# EAGLE design chgr (EAGLE 4.13)
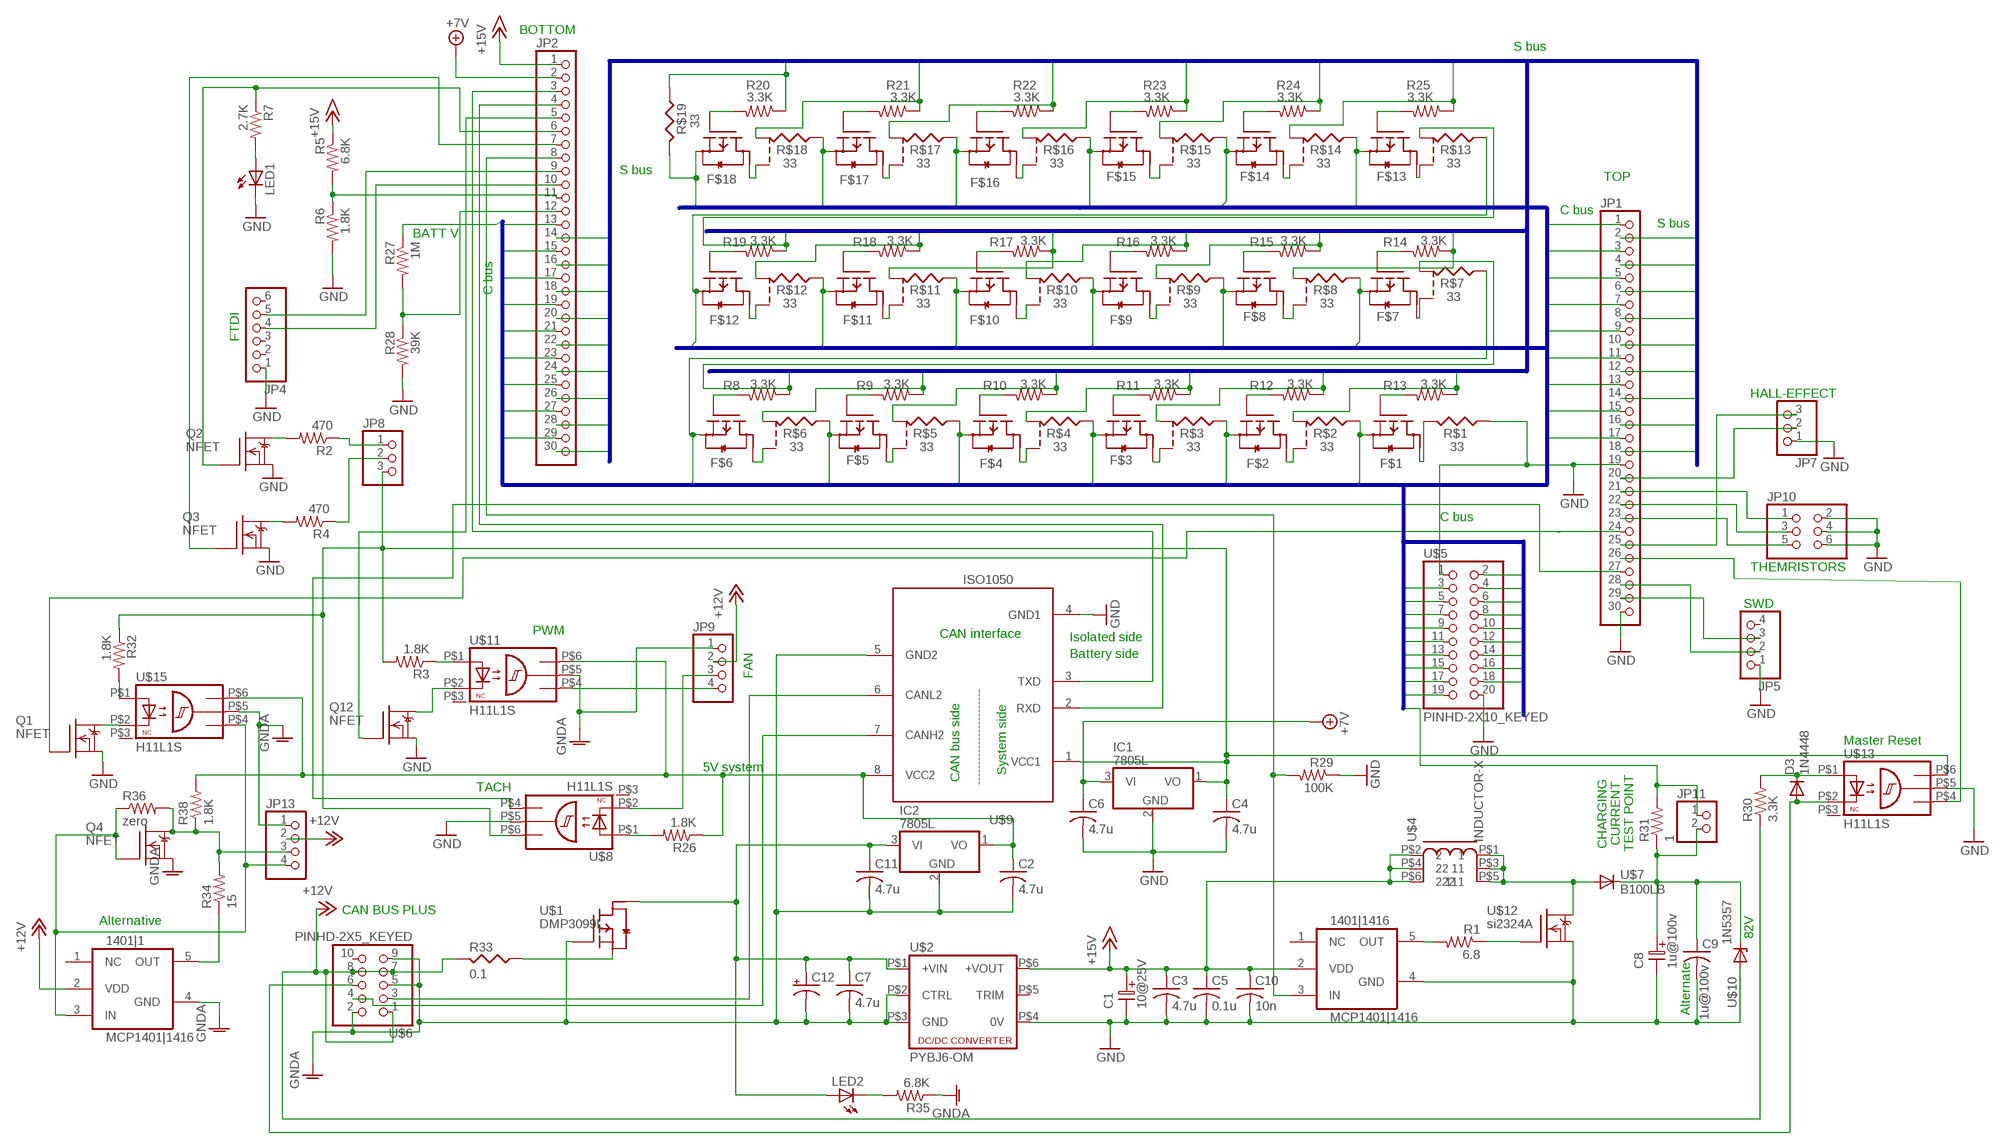
[diagram p0: schematic, sheet 1]

## Parts
1401|1  MCP1401|1416  MCP1416  [SOT23-5]
1401|1416  MCP1401|1416  MCP1416  [SOT23-5]
C1  10@25V  ELC-2,5L  [ES-2,5L]
C2  4.7u  C-USC0603  [C0603]
C3  4.7u  C-USC0805  [C0805]
C4  4.7u  C-USC0603  [C0603]
C5  0.1u  C-USC0603  [C0603]
C6  4.7u  C-USC0603  [C0603]
C7  4.7u  C-USC0603  [C0603]
C8  1u@100v  ELC-2,5L  [ES-2,5L]
C9  1u@100v  C-USC1206  [C1206]
C10  10n  C-USC0603  [C0603]
C11  4.7u  C-USC0805  [C0805]
C12  CPOL-USE5-8.5  [E5-8,5]
D3  1N4448  DIODE-SOD123  [SOD123]
F$1  FET-P-SOT23  [SOT-23]
F$2  FET-P-SOT23  [SOT-23]
F$3  FET-P-SOT23  [SOT-23]
F$4  FET-P-SOT23  [SOT-23]
F$5  FET-P-SOT23  [SOT-23]
F$6  FET-P-SOT23  [SOT-23]
F$7  FET-P-SOT23  [SOT-23]
F$8  FET-P-SOT23  [SOT-23]
F$9  FET-P-SOT23  [SOT-23]
F$10  FET-P-SOT23  [SOT-23]
F$11  FET-P-SOT23  [SOT-23]
F$12  FET-P-SOT23  [SOT-23]
F$13  FET-P-SOT23  [SOT-23]
F$14  FET-P-SOT23  [SOT-23]
F$15  FET-P-SOT23  [SOT-23]
F$16  FET-P-SOT23  [SOT-23]
F$17  FET-P-SOT23  [SOT-23]
F$18  FET-P-SOT23  [SOT-23]
IC1  7805L  [TO92]
IC2  7805L  [TO92]
JP1  PINHD-1X30  [1X30]
JP2  PINHD-1X30  [1X30]
JP4  PINHD-1X6  [1X06]
JP5  PINHD-1X4  [1X04]
JP7  PINHD-1X3  [1X03]
JP8  PINHD-1X3  [1X03]
JP9  PINHD-1X4  [1X04]
JP10  PINHD-2X3  [2X03]
JP11  PINHD-1X2  [1X02]
JP13  PINHD-1X4  [1X04]
LED1  LEDCHIP-LED0603  [CHIP-LED0603]
LED2  LEDCHIP-LED0603  [CHIP-LED0603]
Q1  NFET  DMN3404L  [SOT-23]
Q2  NFET  DMN3404L  [SOT-23]
Q3  NFET  DMN3404L  [SOT-23]
Q4  NFET  DMN3404L  [SOT-23]
Q12  NFET  DMN3404L  [SOT-23]
R1  6.8  R-US_R0603  [R0603]
R2  470  R-US_R0603  [R0603]
R3  1.8K  R-US_R0603  [R0603]
R4  470  R-US_R0603  [R0603]
R5  6.8K  R-US_R0603  [R0603]
R6  1.8K  R-US_R0603  [R0603]
R7  2.7K  R-US_R0603  [R0603]
R8  3.3K  R-US_R0603  [R0603]
R9  3.3K  R-US_R0603  [R0603]
R10  3.3K  R-US_R0603  [R0603]
R11  3.3K  R-US_R0603  [R0603]
R12  3.3K  R-US_R0603  [R0603]
R13  3.3K  R-US_R0603  [R0603]
R14  3.3K  R-US_R0603  [R0603]
R15  3.3K  R-US_R0603  [R0603]
R16  3.3K  R-US_R0603  [R0603]
R17  3.3K  R-US_R0603  [R0603]
R18  3.3K  R-US_R0603  [R0603]
R19  3.3K  R-US_R0603  [R0603]
R20  3.3K  R-US_R0603  [R0603]
R21  3.3K  R-US_R0603  [R0603]
R22  3.3K  R-US_R0603  [R0603]
R23  3.3K  R-US_R0603  [R0603]
R24  3.3K  R-US_R0603  [R0603]
R25  3.3K  R-US_R0603  [R0603]
R26  1.8K  R-US_R0603  [R0603]
R27  1M  R-US_R0603  [R0603]
R28  39K  R-US_R0603  [R0603]
R29  100K  R-US_R0603  [R0603]
R30  3.3K  R-US_R0603  [R0603]
R31  1  R-US_R0603  [R0603]
R32  1.8K  R-US_R0603  [R0603]
R33  0.1  RESUS-S2,5  [RS-2,5]
R34  15  R-US_R0603  [R0603]
R35  6.8K  R-US_R0603  [R0603]
R36  zero  R-US_R0603  [R0603]
R38  1.8K  R-US_R0603  [R0603]
R$1  33  RESUS-S2,5  [RS-2,5]
R$2  33  RESUS-S2,5-2  [RS-2,5-2]
R$3  33  RESUS-S2,5-2  [RS-2,5-2]
R$4  33  RESUS-S2,5-2  [RS-2,5-2]
R$5  33  RESUS-S2,5-2  [RS-2,5-2]
R$6  33  RESUS-S2,5-2  [RS-2,5-2]
R$7  33  RESUS-S2,5-2  [RS-2,5-2]
R$8  33  RESUS-S2,5-2  [RS-2,5-2]
R$9  33  RESUS-S2,5-2  [RS-2,5-2]
R$10  33  RESUS-S2,5-2  [RS-2,5-2]
R$11  33  RESUS-S2,5-2  [RS-2,5-2]
R$12  33  RESUS-S2,5-2  [RS-2,5-2]
R$13  33  RESUS-S2,5-2  [RS-2,5-2]
R$14  33  RESUS-S2,5-2  [RS-2,5-2]
R$15  33  RESUS-S2,5-2  [RS-2,5-2]
R$16  33  RESUS-S2,5-2  [RS-2,5-2]
R$17  33  RESUS-S2,5-2  [RS-2,5-2]
R$18  33  RESUS-S2,5-2  [RS-2,5-2]
R$19  33  RESUS-S2,5  [RS-2,5]
U$1  DMP3099L  FET-P-SOT23  [SOT-23]
U$2  PYBJ6-OM  [PYBJ6-OM]
U$4  INDUCTOR-X  [INDUCTOR]
U$5  PINHD-2X10_KEYED  [2X10_KEYED]
U$6  PINHD-2X5_KEYED  [2X05_KEYED]
U$7  B100LB  [SMB_1]
U$8  H11L1S  H!!LX  [SMD-6]
U$9  ISO1050  [PDSO-G8]
U$10  1N5357  ZENER-5W-VERT  [ZENER-VERT]
U$11  H11L1S  H!!LX  [SMD-6]
U$12  si2324A  DMN3404L  [SOT-23]
U$13  H11L1S  H!!LX  [SMD-6]
U$15  H11L1S  H!!LX  [SMD-6]

## Nets
15VDIVIDED: JP2.11 R5.2 R6.1
+5VA: C2.1 IC2.1(VO) R26.1 R38.2 U$9.8(VCC2) U$11.P$6(VCC) U$15.P$6(VCC)
+5VB: C4.1 IC1.1(VO) JP8.3 R3.2 R32.1 U$8.P$6(VCC) U$9.1(VCC1) U$13.P$6(VCC)
+7V: C6.1 IC1.3(VI) JP2.2
+12V: 1401|1.2(VDD) JP9.2 JP13.2 R30.1 R33.2 U$6.1 U$6.7 U$6.8
+15V: 1401|1416.2(VDD) C1.1 C3.1 C5.1 C10.1 JP2.1 R5.1 U$2.P$6(+VOUT) U$4.P$2 U$4.P$4 U$4.P$6
ALT-MCP1416-OUT-HDR: JP13.3 Q4.3(D) R34.2 R36.2 R38.1
ALT-MCP1416-OUT-R: 1401|1.5(OUT) R34.1
BATVDIVIDED: JP2.12 R27.2 R28.1
BMS-5V: JP1.25 JP7.3
C1: F$1.2(S) JP1.17 R$2.1 U$5.11
C2: F$2.2(S) JP1.15 R$3.1 U$5.2
C3: F$3.2(S) JP1.13 R$4.1 U$5.12
C4: F$4.2(S) JP1.11 R$5.1 U$5.3
C5: F$5.2(S) JP1.9 R$6.1 U$5.13
C6: F$6.2(S) JP1.7 R$7.1 U$5.4
C7: F$7.2(S) JP1.5 R$8.1 U$5.14
C8: F$8.2(S) JP1.3 R$9.1 U$5.5
C9: F$9.2(S) JP1.1 R$10.1 U$5.15
C10: F$10.2(S) JP2.29 R$11.1 U$5.6
C11: F$11.2(S) JP2.27 R$12.1 U$5.16
C12: F$12.2(S) JP2.25 R$13.1 U$5.7
C13: F$13.2(S) JP2.23 R$14.1 U$5.17
C14: F$14.2(S) JP2.21 R$15.1 U$5.8
C15: F$15.2(S) JP2.19 R$16.1 U$5.18
C16: F$16.2(S) JP2.17 R$17.1 U$5.9
C17: F$17.2(S) JP2.15 R$18.1 U$5.19
C18: F$18.2(S) JP2.13 JP11.1 R27.1 R31.2 R$19.2 U$5.10
CAN+12PROTECT: C7.1 C11.1 C12.+ IC2.3(VI) LED2.A U$1.3(D) U$2.P$1(+VIN)
CAN-RX: JP2.4 U$9.2(RXD)
CAN-TX: JP2.3 U$9.3(TXD)
CANH2: U$6.4 U$9.7(CANH2)
CANL2: U$6.3 U$9.6(CANL2)
CHG_FETDRV: 1401|1416.5(OUT) R1.2
CHGR-V+: C8.1 C9.1 JP11.2 R31.1 U$7.C U$10.2(C)
DRAIN$1: F$1.3(D) R$1.2
DRAIN$2: F$2.3(D) R$2.3
DRAIN$3: F$3.3(D) R$3.3
DRAIN$4: F$4.3(D) R$4.3
DRAIN$5: F$5.3(D) R$5.3
DRAIN$6: F$6.3(D) R$6.3
DRAIN$7: F$7.3(D) R$7.3
DRAIN$8: F$8.3(D) R$8.3
DRAIN$9: F$9.3(D) R$9.3
DRAIN$10: F$10.3(D) R$10.3
DRAIN$11: F$11.3(D) R$11.3
DRAIN$12: F$12.3(D) R$12.3
DRAIN$13: F$13.3(D) R$13.3
DRAIN$14: F$14.3(D) R$14.3
DRAIN$15: F$15.3(D) R$15.3
DRAIN$16: F$16.3(D) R$16.3
DRAIN$17: F$17.3(D) R$17.3
DRAIN$18: F$18.3(D) R$18.3
FANFETGATE: JP2.5 Q12.1(G)
FANPWN: JP9.4 U$11.P$4(OUT)
FANTACH-H11DIODE: JP9.3 U$8.P$2(C)
FANTACH-H11L1OUT: JP1.27 U$8.P$4(OUT)
FANTACH-RESISTOR: R26.2 U$8.P$1(A)
GHR_FET_GATE: R1.1 U$12.1(G)
GND: 1401|1416.4(GND) C1.2 C3.2 C4.2 C5.2 C6.2 C8.2 C9.2 C10.2 IC1.2(GND) JP1.19 JP1.30 JP4.1 JP5.1 JP7.1 JP10.2 JP10.4 JP10.6 LED1.C Q1.2(S) Q2.2(S) Q3.2(S) Q12.2(S) R6.2 R28.2 R29.1 R$1.1 U$2.P$4(0V) U$5.1 U$5.20 U$8.P$5(GND) U$9.4(GND1) U$10.1(A) U$12.2(S) U$13.P$5(GND)
GNDA: 1401|1.4(GND) C2.2 C7.2 C11.2 C12.- IC2.2(GND) JP9.1 JP13.1 Q4.2(S) R35.1 U$1.1(G) U$2.P$2(CTRL) U$2.P$3(GND) U$6.2 U$6.5 U$6.9 U$9.5(GND2) U$11.P$5(GND) U$15.P$5(GND)
H11L-PWM-R: R3.1 U$11.P$1(A)
H11PWM-FETDRV: Q12.3(D) U$11.P$2(C)
HE-G5: JP1.20 JP7.2
LED1A: LED1.A R7.2
LED1DRIVE: JP8.1 R2.1
LED1FETDRAIN: Q2.3(D) R2.2
LED1R: JP2.6 Q2.1(G) R7.1
LED2: JP2.7 Q3.1(G)
LED2DRIVE: JP8.2 R4.1
LED2FETDRAIN: Q3.3(D) R4.2
LED_BUS_PWR: LED2.C R35.2
MASTER-RESET-PROC: JP1.26 U$13.P$4(OUT)
MASTER-RESET-RESISTOR: D3.C R30.2 U$13.P$1(A)
MASTER-RESET-SYS: D3.A U$6.6 U$13.P$2(C)
MCP1416_IN: 1401|1416.3(IN) JP2.8 R29.2
N$1: F$18.1(G) R20.2
N$2: R33.1 U$1.2(S)
N$6: U$4.P$1 U$4.P$3 U$4.P$5 U$7.A U$12.3(D)
N$9: F$17.1(G) R21.2
N$16: F$16.1(G) R22.2
N$17: F$15.1(G) R23.2
N$18: F$14.1(G) R24.2
N$19: F$13.1(G) R25.2
N$20: F$7.1(G) R14.2
N$21: F$8.1(G) R15.2
N$22: F$9.1(G) R16.2
N$23: F$10.1(G) R17.2
N$24: F$11.1(G) R18.2
N$25: F$12.1(G) R19.2
N$26: F$6.1(G) R8.2
N$27: F$5.1(G) R9.2
N$28: F$4.1(G) R10.2
N$29: F$3.1(G) R11.2
N$30: F$2.1(G) R12.2
N$49: F$1.1(G) R13.2
PC7-FET-DRAIN: Q1.3(D) U$15.P$2(C)
PC7-T8C1: JP1.24 Q1.1(G)
S1: JP1.18 R13.1 R$2.2
S2: JP1.16 R12.1 R$3.2
S3: JP1.14 R11.1 R$4.2
S4: JP1.12 R10.1 R$5.2
S5: JP1.10 R9.1 R$6.2
S6: JP1.8 R8.1 R$7.2
S7: JP1.6 R14.1 R$8.2
S8: JP1.4 R15.1 R$9.2
S9: JP1.2 R16.1 R$10.2
S10: JP2.30 R17.1 R$11.2
S11: JP2.28 R18.1 R$12.2
S12: JP2.26 R19.1 R$13.2
S13: JP2.24 R25.1 R$14.2
S14: JP2.22 R24.1 R$15.2
S15: JP2.20 R23.1 R$16.2
S16: JP2.18 R22.1 R$17.2
S17: JP2.16 R21.1 R$18.2
S18: JP2.14 R20.1 R$19.1
SWCLK: JP1.28 JP5.2
SWO: JP1.29 JP5.3
THERM1-G2: JP1.23 JP10.5
THERM2-G3: JP1.22 JP10.3
THERM3-G4: JP1.21 JP10.1
U$15-H11L-ANODE: R32.2 U$15.P$1(A)
U$15OUT: 1401|1.3(IN) JP13.4 Q4.1(G) R36.1 U$15.P$4(OUT)
USART1-RX: JP2.10 JP4.4
USART1-TX: JP2.9 JP4.5
Unconnected: 1401|1.1(NC) 1401|1416.1(NC) JP4.2 JP4.3 JP4.6 JP5.4 U$2.P$5(TRIM) U$6.10 U$8.P$3(NC) U$11.P$3(NC) U$13.P$3(NC) U$15.P$3(NC)

## Buses
C$1:C[0..18]
S$!:S[0..18]

## Notes on the sheet
- BOTTOM
- S bus
- S bus
- TOP
- C bus
- S bus
- BATT V
- C bus
- FTDI
- HALL-EFFECT
- C bus
- THEMRISTORS
- SWD
- PWM | CAN interface
- Isolated side
- Battery side
- FAN
- Master Reset
- 5V system | System side
- CAN bus side | ------------------------
- TACH
- CHARGING | CURRENT
- TEST POINT
- CAN BUS PLUS
- Alternative
- 82V
- Alternate

## Library data of the parts
1401|1 1401|1416 = DEH:MCP1416
C1 C8 = DEH:ELC-2,5L
C2-C7 C9-C11 = rcl:C-US: CAPACITOR, American symbol
C12 = rcl:CPOL-US: POLARIZED CAPACITOR, American symbol
D3 = diode:DIODE-: DIODE
F$1-F$18 U$1 = transistor-fet:FET-P-SOT23
IC1 IC2 = linear:78*: Positive VOLTAGE REGULATOR
JP1 JP2 = pinhead:PINHD-1X30: PIN HEADER
JP4 = pinhead:PINHD-1X6: PIN HEADER
JP5 JP9 JP13 = pinhead:PINHD-1X4: PIN HEADER
JP7 JP8 = pinhead:PINHD-1X3: PIN HEADER
JP10 = pinhead:PINHD-2X3: PIN HEADER
JP11 = pinhead:PINHD-1X2: PIN HEADER
LED1 LED2 = led:LED: LED OSRAM: - CHIPLED LG R971, LG N971, LY N971, LG Q971, LY Q971, LO R971, LY R971 LH N974, LH R974 LS Q976, LO Q976, LY Q976 LO Q996 - Hyper CHIPLED LW Q18S LB Q993, LB Q99A, LB R99A - SideLED LS A670, LO A670, LY A670, LG A670, LP A670 LB A673, LV A673, LT A673, LW A673 LH A674 LY A675 LS A676, LA A676, LO A676, LY A676, LW A676 LS A679, LY A679, LG A679 - Hyper Micro SIDELED® LS Y876, LA Y876, LO Y876, LY Y876 LT Y87S - SmartLED LW L88C, LW L88S LB L89C, LB L89S, LG L890 LS L89K, LO L89K, LY L89K LS L896, LA L896, LO L896, LY L896 - TOPLED LS T670, LO T670, LY T670, LG T670, LP T670 LSG T670, LSP T670, LSY T670, LOP T670, LYG T670 LG T671, LOG T671, LSG T671 LB T673, LV T673, LT T673, LW T673 LH T674 LS T676, LA T676, LO T676, LY T676, LB T676, LH T676, LSB T676, LW T676 LB T67C, LV T67C, LT T67C, LS T67K, LO T67K, LY T67K, LW E67C LS E67B, LA E67B, LO E67B, LY E67B, LB E67C, LV E67C, LT E67C LW T67C LS T679, LY T679, LG T679 LS T770, LO T770, LY T770, LG T770, LP T770 LB T773, LV T773, LT T773, LW T773 LH T774 LS E675, LA E675, LY E675, LS T675 LS T776, LA T776, LO T776, LY T776, LB T776 LHGB T686 LT T68C, LB T68C - Hyper Mini TOPLED® LB M676 - Mini TOPLED Santana® LG M470 LS M47K, LO M47K, LY M47K Source: http://www.osram.convergy.de/
Q1-Q4 Q12 U$12 = transistor-fet:DMN3404L
R1-R32 R34-R36 R38 = rcl:R-US_: RESISTOR, American symbol
R33 R$1 R$19 = DEH:RESUS-S2,5
R$2-R$18 = DEH:RESUS-S2,5-2
U$2 = dc-dc-converter:PYBJ6-OM
U$4 = DEH:INDUCTOR-X
U$5 = pinhead:PINHD-2X10_KEYED
U$6 = pinhead:PINHD-2X5_KEYED
U$7 = diode-1:B100LB
U$8 U$11 U$13 U$15 = optocoupler:H!!LX
U$9 = texas:ISO1050
U$10 = DEH:ZENER-5W-VERT

## Board
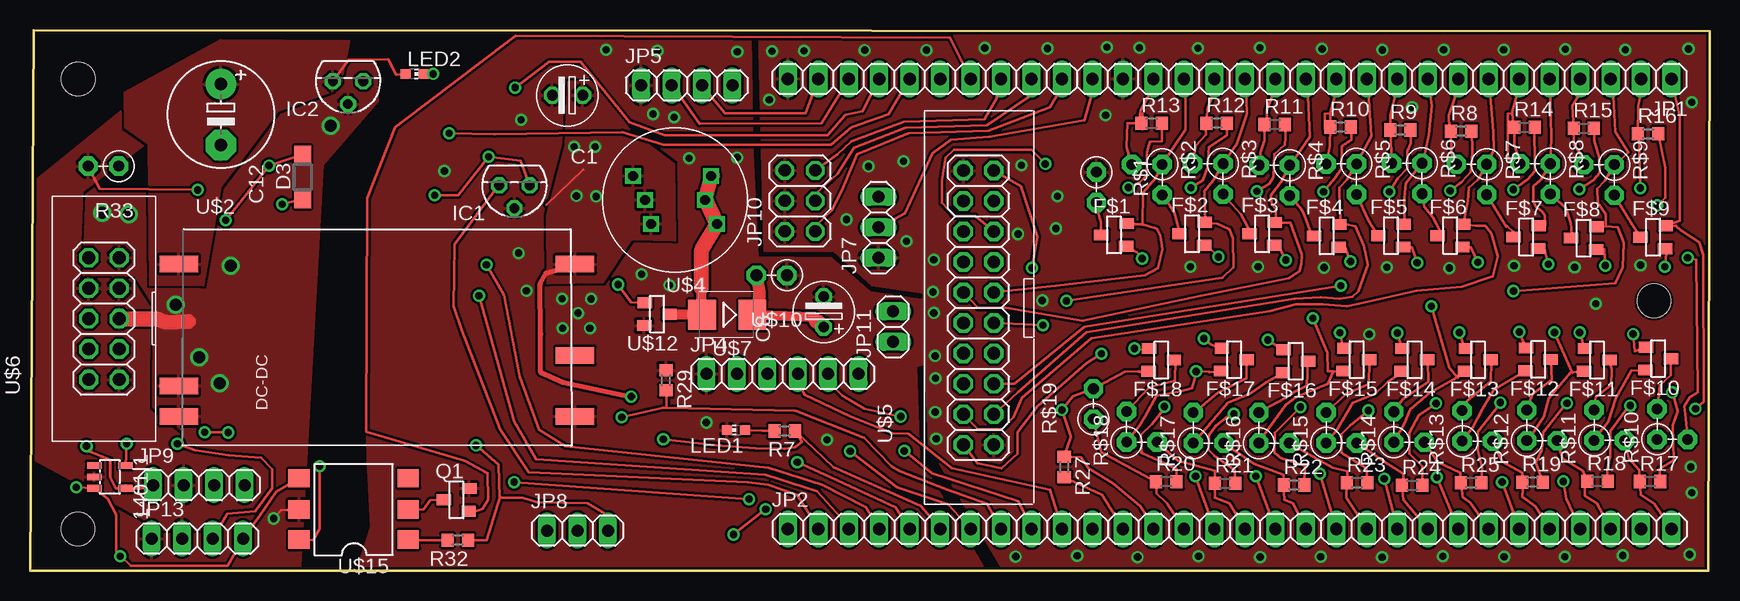
[diagram p1: board, top side]
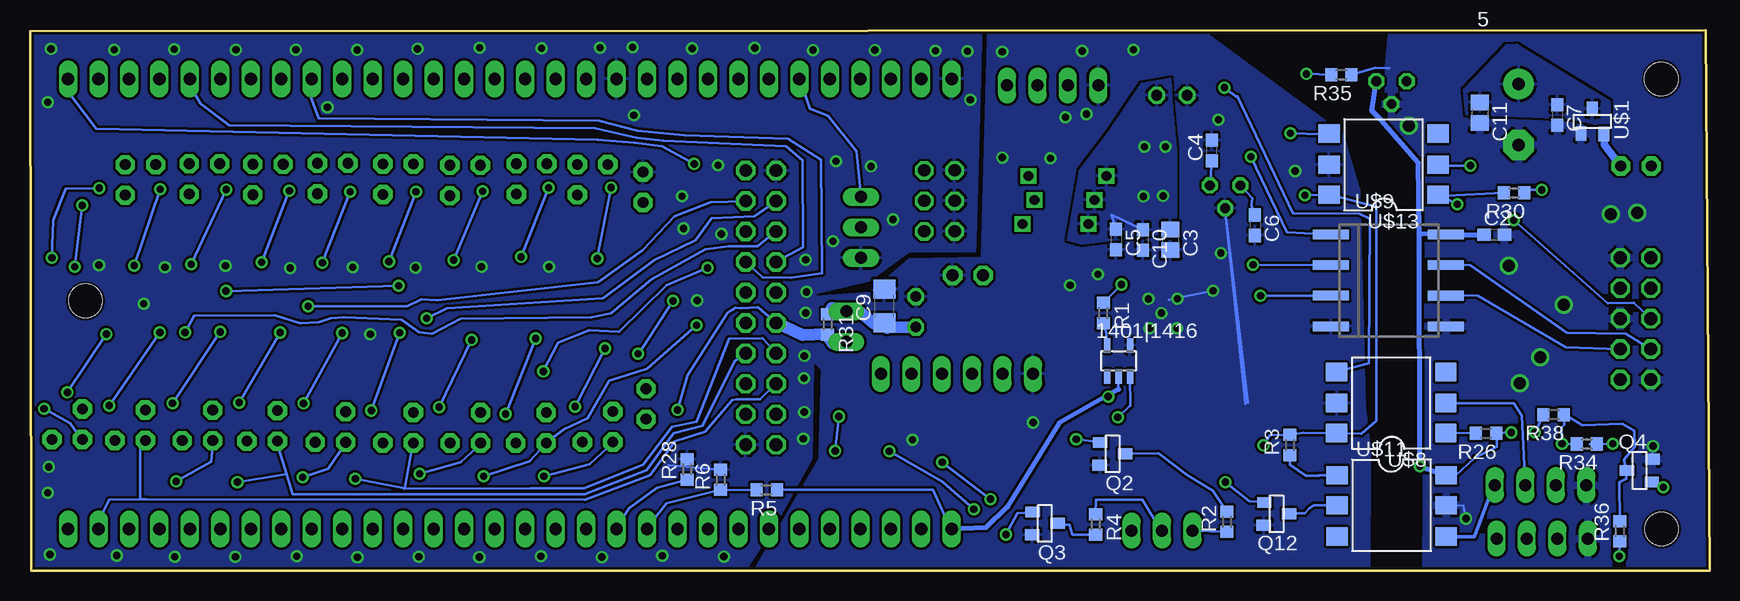
[diagram p2: board, bottom side, seen from below]

Size 140 x 45.08 mm. Coordinates in mm from the lower left corner, seen from the top.
Outline: 140,44.99 139.91,0.02 0,0 0.32,45.08 139.98,44.99
Copper layers (1*16): Top 0.035mm / dielectric 1.5mm / Bottom 0.035mm
Design rules "default": minimum track width 8mil, minimum drill 0.6mm, track to track 0.2083mm, track to pad 8mil, pad to pad 8mil, via to via 8mil, smd to smd 0mil, copper to edge 8mil, drill to drill 8mil, minimum pad ring 10mil, minimum via ring 8mil, stop-mask expansion 4mil, vias tented up to drill 0mil, thermal gap 10mil
Holes 2.8 mm at 135.37,22.51 4.01,40.99 4,3.49

### Footprints (pad centres in the part's own frame; a part is rotated, then mirrored left to right if it is on the bottom)
SOT23-5 = smd 0.55 x 1.2: 1 -0.95,-1.3; 2 0,-1.3; 3 0.95,-1.3; 4 0.95,1.3; 5 -0.95,1.3
ES-2,5L = drill 0.889 pad 1.27 octagon: 1 0,0; 2 2.54,0
C0603 = smd 1.1 x 1: 1 -0.85,0; 2 0.85,0
C0805 = smd 1.3 x 1.5: 1 -0.85,0; 2 0.85,0
C1206 = smd 1.6 x 1.8: 1 -1.4,0; 2 1.4,0
E5-8,5 = drill 1.016 pad 2.54 round: + -2.54,0 | drill 1.016 pad 2.54 octagon: - 2.54,0
SOD123 = smd 1.4 x 1.4: A 1.9,0; C -1.9,0
SOT-23 = smd 0.9 x 1.2: 1 -1,-1.006; 2 0.9,-1.056; 3 -0.05,1.056
TO92 = drill 0.813 octagon: 1 -1.27,0; 2 0,1.905; 3 1.27,0
1X30 = drill 1.016 long: 1 -36.83,0; 2 -34.29,0; 3 -31.75,0; 4 -29.21,0; 5 -26.67,0; 6 -24.13,0; 7 -21.59,0; 8 -19.05,0; 9 -16.51,0; 10 -13.97,0; 11 -11.43,0; 12 -8.89,0; 13 -6.35,0; 14 -3.81,0; 15 -1.27,0; 16 1.27,0; 17 3.81,0; 18 6.35,0; 19 8.89,0; 20 11.43,0; 21 13.97,0; 22 16.51,0; 23 19.05,0; 24 21.59,0; 25 24.13,0; 26 26.67,0; 27 29.21,0; 28 31.75,0; 29 34.29,0; 30 36.83,0
1X06 = drill 1 long: 1 -6.35,0; 2 -3.81,0; 3 -1.27,0; 4 1.27,0; 5 3.81,0; 6 6.35,0
1X04 = drill 1 long: 1 -3.81,0; 2 -1.27,0; 3 1.27,0; 4 3.81,0
1X03 = drill 1 long: 1 -2.54,0; 2 0,0; 3 2.54,0
2X03 = drill 1.016 octagon: 1 -2.54,-1.27; 2 -2.54,1.27; 3 0,-1.27; 4 0,1.27; 5 2.54,-1.27; 6 2.54,1.27
1X02 = drill 1 long: 1 -1.27,0; 2 1.27,0
CHIP-LED0603 = smd 0.8 x 0.8: A 0,-0.75; C 0,0.75
R0603 = smd 1 x 1.1: 1 -0.85,0; 2 0.85,0
RS-2,5 = drill 0.889 pad 1.6 octagon: 1 0,0; 2 2.54,0
RS-2,5-2 = drill 0.889 pad 1.6 octagon: 1 0,0; 2 2.54,0; 3 0,2.54
PYBJ6-OM = smd 3.2 x 1.397: P$1 -16.51,6.35; P$2 -16.51,-3.81; P$3 -16.51,-6.35; P$4 16.51,-6.35; P$5 16.51,-1.27; P$6 16.51,6.35
INDUCTOR = drill 0.8 square: P$1 -3.5,2; P$2 2,2; P$3 -2.5,0; P$4 2.5,0; P$5 -3,-2; P$6 3.5,-2
2X10_KEYED = drill 1.067 octagon: 1 -11.46,-1.27; 2 -11.46,1.27; 3 -8.92,-1.27; 4 -8.92,1.27; 5 -6.38,-1.27; 6 -6.38,1.27; 7 -3.84,-1.27; 8 -3.84,1.27; 9 -1.3,-1.27; 10 -1.3,1.27; 11 1.24,-1.27; 12 1.24,1.27; 13 3.78,-1.27; 14 3.78,1.27; 15 6.32,-1.27; 16 6.32,1.27; 17 8.86,-1.27; 18 8.86,1.27; 19 11.4,-1.27; 20 11.4,1.27
2X05_KEYED = drill 1.067 octagon: 1 -5.08,-1.27; 2 -5.08,1.27; 3 -2.54,-1.27; 4 -2.54,1.27; 5 0,-1.27; 6 0,1.27; 7 2.54,-1.27; 8 2.54,1.27; 9 5.08,-1.27; 10 5.08,1.27
SMB_1 = smd 2.3 x 2.5: A 1.9,0; C -2.3,0
SMD-6 = smd 1.52 x 1.78: P$1 -2.5,-4.5; P$2 0,-4.5; P$3 2.6,-4.5; P$4 2.6,4.6; P$5 0,4.6; P$6 -2.5,4.6
PDSO-G8 = smd 0.8 x 3: 1 -3.825,-4.8; 2 -1.275,-4.8; 3 1.265,-4.78; 4 3.825,-4.8; 5 3.825,4.8; 6 1.275,4.8; 7 -1.275,4.81; 8 -3.825,4.81
ZENER-VERT = drill 1 pad 1.6 octagon: 1 0,0; 2 2.54,0

### Placement (x,y rotation side)
1401|1  6.66,7.84 270 top
1401|1416  49.25,17.5 0 bottom
C1  46.08,39.64 180 top
C2  17.94,28.03 0 bottom
C3  44.93,27.6 270 bottom
C4  41.48,35.04 90 bottom
C5  49.46,27.62 270 bottom
C6  37.89,28.81 270 bottom
C7  12.7,38 270 bottom
C8  66.16,20.32 90 top
C9  68.77,22.08 90 bottom
C10  47.25,27.58 270 bottom
C11  19.15,38.19 270 bottom
C12  15.91,38.04 270 top
D3  22.73,32.83 90 top
F$1  90.36,28.05 90 top
F$2  96.87,28.15 90 top
F$3  102.71,28.14 90 top
F$4  108.09,27.97 90 top
F$5  113.45,27.99 90 top
F$6  118.39,27.99 90 top
F$7  124.71,27.88 90 top
F$8  129.52,27.79 90 top
F$9  135.3,27.86 90 top
F$10  135.72,17.64 270 top
F$11  130.61,17.53 270 top
F$12  125.71,17.58 270 top
F$13  120.69,17.54 270 top
F$14  115.4,17.54 270 top
F$15  110.57,17.56 270 top
F$16  105.49,17.43 270 top
F$17  100.36,17.56 270 top
F$18  94.3,17.53 270 top
IC1  40.38,32.13 180 top
IC2  26.51,40.81 180 top
JP1  100,41 180 top
JP2  100,3.5 0 top
JP4  62.73,16.42 0 top
JP5  54.75,40.47 0 top
JP7  70.73,28.63 90 top
JP8  45.63,3.37 0 top
JP9  14.08,7.16 0 top
JP10  64.19,30.84 90 top
JP11  71.95,20.36 90 top
JP13  13.94,2.7 0 top
LED1  58.85,11.74 90 top
LED2  32.06,41.41 270 top
Q1  35.56,5.98 90 top
Q2  49.77,9.71 270 bottom
Q3  55.4,3.92 270 bottom
Q4  5.82,8.42 90 bottom
Q12  36.1,4.71 270 bottom
R1  50.53,21.49 270 bottom
R2  40.22,4.1 90 bottom
R3  34.97,10.49 90 bottom
R4  51.17,3.87 270 bottom
R5  78.59,6.76 180 bottom
R6  82.43,7.6 90 bottom
R7  62.9,11.67 180 top
R8  119.29,36.65 0 top
R9  114.23,36.75 0 top
R10  109.24,36.99 0 top
R11  103.76,37.21 0 top
R12  98.92,37.32 0 top
R13  93.49,37.31 0 top
R14  124.57,36.97 0 top
R15  129.52,36.89 0 top
R16  134.89,36.43 0 top
R17  135.05,7.45 0 top
R18  130.66,7.47 0 top
R19  125.24,7.4 0 top
R20  94.72,7.44 0 top
R21  99.63,7.3 0 top
R22  105.37,7.17 0 top
R23  110.63,7.35 0 top
R24  115.22,7.14 0 top
R25  120.12,7.35 0 top
R26  18.63,11.47 180 bottom
R27  86.2,8.66 270 top
R28  85.22,8.47 90 bottom
R29  53.01,15.89 270 top
R30  16.29,31.51 180 bottom
R31  73.51,20.55 270 bottom
R32  35.66,2.57 180 top
R33  7.39,33.74 180 top
R34  10.23,10.58 180 bottom
R35  30.69,41.35 180 bottom
R36  7.48,3.31 90 bottom
R38  12.99,13.03 180 bottom
R$1  88.9,33.24 270 top
R$2  94.38,33.88 180 top
R$3  99.45,33.94 180 top
R$4  105,33.81 180 top
R$5  110.58,33.92 180 top
R$6  116.04,33.98 180 top
R$7  121.43,33.89 180 top
R$8  126.73,33.94 180 top
R$9  132.06,33.86 180 top
R$10  135.63,10.96 0 top
R$11  130.38,10.88 0 top
R$12  124.77,10.86 0 top
R$13  119.38,10.82 0 top
R$14  113.69,10.73 0 top
R$15  108.05,10.67 0 top
R$16  102.44,10.66 0 top
R$17  96.97,10.66 0 top
R$18  91.41,10.74 0 top
R$19  88.64,12.65 90 top
U$1  9.71,37.46 0 bottom
U$2  28.92,19.23 0 top
U$4  53.77,30.92 180 top
U$5  79.07,21.97 90 top
U$6  6.17,21.03 90 top
U$7  57.92,21.35 180 top
U$8  26.48,13.99 90 bottom
U$9  26.78,24.21 270 bottom
U$10  63.09,24.63 180 top
U$11  26.55,5.47 270 bottom
U$12  52.26,21.35 270 top
U$13  27.12,33.85 90 bottom
U$15  27.02,5.12 90 top

### Tracks (layer width: path | path; a pad name or v marks a point on that pad's centre or on a via)
15VDIVIDED
  Bottom 0.203: JP2.11 88.66,3.47 86.94,5.66 R6.1 82.62,6.72 R5.2
+5VA  (via drill 0.6)
  Top 0.203: U$15.P$6 23.6,2.57 24.14,3.52 v24.14,8.72 | v16.52,11.54 v14.55,11.57
  Bottom 0.203: U$11.P$6 21.9,7.94 21.18,7.94 19.58,9.43 17.75,10.34 R26.1 v16.52,11.54 | v24.14,8.72 24.16,8.82 | R38.2 13.82,13.03 v14.55,11.57
  Bottom 0.406: IC2.1 28.16,38.37 27.36,37.56 24.26,34 24.17,28.15 | 24.17,28.15 24.16,8.82 24.16,8.73 21.92,7.92 U$11.P$6 | 24.17,28.15 24.02,28.06 | 24.17,28.15 U$9.8 C2.1
+5VB  (via drill 0.6)
  Top 0.203: IC1.1 40.9,34.2 v38.24,34.52 35.68,31.31 v33.73,31.3 | JP8.3 48.14,4.63 46.49,5.65 42.28,5.73 41.06,6.12 39.19,6.12 | v37.17,10.46 39.06,8.84 39.13,6.12 39.19,6.12 | R32.1 38.07,2.57 39.19,6.19 39.19,6.12
  Bottom 0.203: U$9.1 35.22,28.23 v38.24,34.52 | v33.73,31.3 U$13.P$6 31.77,31.38 27.79,30.36 27.79,12.51 29.04,11.44 U$8.P$6 33.86,11.53 35.01,11.37 R3.2 36.65,11.31 37.21,10.44 v37.17,10.46 | IC1.1 C4.1
+7V
  Top 0.203: JP2.2 63.92,6.35 61.54,7.19 59.86,7.38 41.58,8.24 39.17,11.83 35.99,20.12 35.33,22.05 35.39,27.24 39.08,32.15 IC1.3
  Bottom 0.203: IC1.3 38.11,31.08 38.17,30.48 C6.1
+12V  (via drill 0.6)
  Top 0.203: v13.97,31.75 5.81,31.87 4.8,33.72 R33.2
  Bottom 0.203: v13.97,31.75 15.24,31.75 R30.1
  pour Top (rank 2): 9.16,39.54 0.31,32.41 0.23,9.35 11.18,3.42 20.6,3.37 20.55,5.15 20.19,8.59 18.22,9.47 13.53,10.48 9.91,13.44 9.92,21.99 8.47,24.26 4.82,24.34 4.05,24.16 4.36,31.64 10.88,36.58 11.34,37.67 11.45,38.17 10.18,39.5
+15V  (via drill 0.6)
  Top 0.203: 43.05,30.52 46.09,33.43 | 45.5,25.6 U$2.P$6
  Top 0.406: v50.12,14.53 44.43,15.71 42.58,16.54 42.58,19.74 42.53,23.93 43,24.83 45.5,25.6
  Bottom 0.203: 63.35,3.47 JP2.1 63.17,3.34 64.73,6.75 77.08,6.77 77.61,6.81 R5.1 | 47.53,28.73 C10.1 49.85,29.7 C5.1 | 49.26,15.14 1401|1416.2 49.32,15.07 v50.12,14.53
  Bottom 0.406: 63.35,3.47 60.31,3.61 58.51,5.34 54.19,12.34 49.26,15.14
  other vias: 45.55,31.25 47.19,31.21 45.36,35.36 47.11,35.36
  pour Top: 44.65,35.4 44.79,38.48 44.91,40.78 46.97,40.78 50.05,36.6 53.68,33.9 53.79,27.54 50.11,27.63 47.73,24.06 43.13,23.98 43.11,29.57
  pour Bottom: 44.5,30.23 44.5,28.24 52.33,27.25 53.49,27.62 52.49,33.37 49.98,36.63 47.31,40.59 44.95,41 44.8,38.57 44.47,35.14
ALT-MCP1416-OUT-HDR  (via drill 0.6)
  Top 0.203: JP13.3 16.44,4.76 18.78,4.97 20.18,6.89 20.17,8.49 19.25,9.42 16.56,9.66 13.77,10.06 v12.29,10.59
  Bottom 0.203: R34.2 v12.29,10.59 12.35,11.95 12.12,12.19 12.12,13.09 R38.1 12.02,13.01 10.62,12.16 7.26,12.25 6.29,11.67 6.25,10.36 7.14,9.25 Q4.3 6.98,8.37 6.93,7.67 7.52,7.4 R36.2
ALT-MCP1416-OUT-R  (via drill 0.6)
  Top 0.203: 1401|1.5 v8.06,10.59
  Bottom 0.203: R34.1 9.98,10.57 v8.06,10.59
BATVDIVIDED
  Top 0.203: R27.2 89.34,6.36 91.2,3.43 JP2.12
  Bottom 0.203: JP2.12 91.27,3.36 90.08,5.23 87.71,6.92 R28.1
BMS-5V
  Bottom 0.203: JP7.3 71.1,34.98 73.5,37.92 74.98,38.52 75.86,41.02 JP1.25
C1
  Top 0.203: U$5.11 85.52,23.78 92.94,24.66 94.04,25.22 94.41,26.79 94.22,27.92 93.93,28.53 92.71,28.91 | JP1.17 96.32,40.44 96.3,36.77 94.31,33.83 | F$1.2 91.68,28.89 92.71,28.91 | 94.31,33.83 R$2.1 | 94.31,33.83 93.84,32.77 92.78,31.51 92.71,28.84 92.71,28.91
C2  (via drill 0.6)
  Top 0.203: U$5.2 78.96,8.98 80.97,8.55 82.32,9.77 82.32,11.56 83.98,13.72 88.08,17.32 v89.31,18.09 | v86.39,22.5 99.38,24.43 100.33,25.32 100.27,27.71 99.97,28.48 98.97,28.94 97.97,28.97 F$2.2 97.96,28.97 97.91,31.64 98.65,32.54 R$3.1 99.4,33.87 100.62,35.6 101.44,38.1 101.37,40.42 JP1.15
  Bottom 0.203: v89.31,18.09 88.85,18.71 v86.39,22.5
C3
  Top 0.203: U$5.12 79.04,21.92 81.35,21.93 87.71,20.86 97.62,22.92 104.92,24.4 105.81,24.99 105.99,25.59 106,26.37 105.08,29.01 104,29.02 F$3.2 103.85,29.04 103.87,30.13 103.52,30.53 103.45,31.29 104.26,32.4 R$4.1 105,33.77 106.69,36.17 106.46,40.44 JP1.13
C4
  Top 0.203: U$5.3 82.35,14.91 88.08,19.89 105.41,22.7 107.59,22.79 109.19,22.68 110.21,22.84 110.74,23.29 111.52,25.51 111.17,27.1 110.49,28.74 109.7,28.9 F$4.2 109.25,28.9 109.18,30.02 109.13,31.92 109.78,32.59 R$5.1 110.52,33.84 111.8,36.24 111.52,40.5 JP1.11
C5
  Top 0.203: 115.02,28.75 F$5.2 114.56,28.91 114.58,31.11 114.67,32.31 R$6.1 116.09,33.99 116.62,36.35 116.85,38.77 116.61,40.48 JP1.9
  Bottom 0.203: U$5.13 78.92,24.46 76.59,24.43 73.98,24.8 74.06,34.26 76.81,36 85.44,36.3 89.35,36.67 92.57,37.51 115.94,37.73 116.95,40.42 116.59,40.46 JP1.9
C6
  Top 0.203: U$5.4 79.01,11.8 81,11.8 81.98,12.79 82.68,14.45 88.46,19.41 103.33,21.66 105.54,22.22 107.76,22.24 109.75,22.08 110.78,22.27 115.58,23.35 119.37,23.7 121.95,24.58 122.37,26.21 121.8,28.13 121.32,28.76 120.53,28.75 F$6.2 119.47,28.88 119.86,30.79 119.93,31.94 120.67,32.62 121.4,33.83 | JP1.7 121.66,40.59 121.97,36.55 122,35.12 121.4,33.83 | 121.4,33.83 R$7.1
C7
  Top 0.203: F$7.2 126.3,28.82 126.28,29.63 126,29.97 125.54,30.35 125.3,30.86 125.3,32.04 125.92,32.6 R$8.1 126.8,36.14 126.7,40.96 JP1.5
  Bottom 0.203: U$5.14 75.55,26.98 75.6,34.24 76.99,35.38 87.19,35.86 89.44,36.1 92.9,36.9 123.41,37.16 125.77,38.92 126.71,40.5 JP1.5
C8  (via drill 0.6)
  Top 0.203: 131.35,28.74 132.36,28.64 132.84,27.34 132.79,25.29 132.16,23.97 v123.66,23.33 | U$5.5 82.05,15.59 87.88,20.36 v109.28,23.77 | JP1.3 131.94,40.37 132.16,36.6 133.22,34.88 132.13,33.85 R$9.1 131.25,32.5 130.66,31.87 130.68,30.69 131.37,29.72 131.35,28.74 | 131.35,28.74 F$8.2
  Bottom 0.203: v109.28,23.77 v123.66,23.33
C9  (via drill 0.6)
  Top 0.203: 137.15,28.75 136.39,28.72 F$9.2 137.54,29.2 137.5,37.88 136.92,40.44 JP1.1 | 137.15,28.75 137.21,28.75 | 137.15,28.75 137.72,28.3 139.15,27.38 139.48,26.36 139.51,14.11 v138.83,13.52 | U$5.15 78.8,29.57 77.07,29.54 76.03,30.7 76,32.58 76.33,34.42 77,35.09 83.49,35.11 v84.63,33.92
  Bottom 0.203: v84.63,33.92 87.31,35.39 89.6,35.67 92.68,35.92 134.49,36.84 137.12,40.33 137.11,40.39 JP1.1 | v138.83,13.52 136.65,12.32 135.67,10.93 R$10.1
C10
  Top 0.203: F$10.2 133.46,16.7 132.17,14.39 131.55,12.44 130.24,10.77 R$11.1
  Bottom 0.203: U$5.6 79.15,14.33 81.12,14.33 81.46,14.22 83.73,11.62 86.23,10.83 88.3,7.99 93.71,5.93 130.26,5.97 130.8,5.96 | 130.8,5.96 133.39,5.92 134.59,3.53 | 134.59,3.53 134.68,3.34 | JP2.29 134.51,3.49 134.59,3.53 | R$11.1 130.81,11.43 130.81,6.35 130.8,5.96
C11  (via drill 0.6)
  Top 0.203: 128.56,16.58 128.44,16.57 126.61,14.39 126.18,12.87 124.75,10.74 R$12.1 | 128.56,16.58 F$11.2 | 128.56,16.58 128.56,16.52 v127.08,19.88 | v127.81,7.46 128.08,6.01 JP2.27
  Bottom 0.203: v127.08,19.88 126.33,21.26 119.59,21.33 117.46,20.65 115.95,20.71 114.94,21.05 113.82,21.14 109.01,20.92 107.55,19.88 106.47,19.78 104.09,21 93.19,21.13 91.58,21.46 88.19,24.29 83.7,26.81 81.75,27.06 79.35,27.08 U$5.16 | v127.81,7.46 124.89,9.1 124.72,10.8 R$12.1
C12  (via drill 0.6)
  Top 0.203: F$12.2 124.6,16.65 122,15.09 121.07,13.49 120.26,11.98 119.4,10.84 R$13.1 | v122.71,7.41 JP2.25
  Bottom 0.203: U$5.7 81.29,17.48 83.93,12.09 86.35,11.47 88.6,8.4 93.77,6.4 94.25,6.38 118.09,6.4 118.61,8.06 | R$13.1 119.33,10.36 118.61,8.06 | 118.61,8.06 118.67,8.04 v122.71,7.41
C13  (via drill 0.6)
  Top 0.203: F$13.2 118.98,16.15 | v116.81,22.06 118.33,16.93 119.02,16.1 118.98,16.15 | 118.98,16.15 116.7,14.85 115.08,13.46 114.53,12.17 113.62,10.62 R$14.1 | v117.27,7.82 JP2.23
  Bottom 0.203: U$5.17 83.27,30.72 86.26,29.57 88.92,26.74 92.65,24.07 106.06,22.56 107.34,22.66 108.56,22.08 v116.81,22.06 | v117.27,7.82 115.15,8.53 113.68,10.64 R$14.1
C14  (via drill 0.6)
  Top 0.203: F$14.2 114.34,16.52 113.19,15.75 112.13,14.78 110.26,14 108.9,11.7 108.03,10.64 R$15.1 | v112.88,7.68 JP2.21
  Bottom 0.203: U$5.8 78.93,19.4 81.73,19.37 84.44,12.44 86.49,12 88.9,8.84 93.81,6.88 98.28,6.88 108.77,6.84 | R$15.1 108.1,10.5 108.77,6.84 | 108.77,6.84 108.96,6.92 v112.88,7.68
C15  (via drill 0.6)
  Top 0.203: F$15.2 109.49,16.6 108.67,16.66 | 108.67,16.66 108.18,15.59 105.52,14.47 104.7,13.84 102.35,10.64 R$16.1 | v106.93,21.07 108.14,18.18 108.17,16.63 108.67,16.66 | v107.53,8.11 JP2.19
  Bottom 0.203: U$5.18 79.59,29.54 83.18,29.38 84.53,27.56 87.97,25.9 92.24,22.73 105.22,21.91 v106.93,21.07 | v107.53,8.11 104.12,9.07 102.36,10.64 R$16.1
C16  (via drill 0.6)
  Top 0.203: F$16.2 104.4,16.47 103.07,15.73 | 103.07,15.73 103.04,15.72 | U$5.9 v84.44,20.47 | R$17.1 99.86,14 101.69,14.78 103.07,15.73 | v102.19,7.89 JP2.17
  Bottom 0.203: v84.44,20.47 88.56,16.84 91.71,15.87 93.54,12.71 95.48,11.81 96.97,10.68 R$17.1 96.97,10.64 98.36,9.15 v102.19,7.89
C17  (via drill 0.6)
  Top 0.203: F$17.2 98.3,16.58 98.32,16.59 97.25,16.66 | U$5.19 82.62,32.08 83.99,27.84 v83.53,25.25 | R$18.1 92.48,12.09 92.95,12.85 93.88,14.62 95.92,14.96 | 95.92,14.96 96.86,15.21 97.25,16.66 | 97.25,16.66 v97.21,16.63 | 95.92,14.96 95.91,15.01 | JP2.15 v97.16,7.89
  Bottom 0.203: v83.53,25.25 86.92,23.8 90.91,19.93 93.41,20.04 95.96,19 v97.21,16.63 | v97.16,7.89 93.35,8.89 91.39,10.69 R$18.1
C18  (via drill 0.6)
  Top 0.203: 93.28,16.64 92.41,16.62 92.4,16.64 | JP2.13 93.78,3.49 92.57,5.39 90.27,7.3 88.23,8.58 87.59,9.49 R27.1 86.77,11.19 v86.03,13.42 86.92,14.58 R$19.2 91.28,16.62 92.4,16.64 | F$18.2 92.71,16.51 92.4,16.64
  Bottom 0.203: U$5.10 79.33,21.97 80.75,21.91 81.18,21.92 81.84,21.51 85.2,16.29 v86.03,13.42
  Bottom 1.016: JP11.1 73.09,18.96 73.51,19.63 R31.2 73.59,19.72 75.59,19.65 U$5.10
CAN+12PROTECT
  Top 0.203: 15.59,31.09 15.56,31.09 | LED2.A 30.54,41.37 29.87,42.63 26.56,42.61 25.23,40.78 IC2.3
  pour Top: 26.59,44.13 25.82,40.21 20.65,38.36 16.87,33.33 15.91,32.08 14.44,23.82 10,23.84 9.91,35.62 7.94,36.99 7.91,39.86 15.89,44.23
  pour Bottom: 8.33,39.12 8.33,36.99 11.59,37.74 20.29,38.06 20.46,40.11 16.93,43.79 16.12,43.86
CAN-RX  (via drill 0.6)
  Top 0.203: v38.05,25.51 39.54,22.98 40.8,16.21 42.43,11.78 44.64,10.38 61.56,8.62 66,7.19 69.69,5.29 JP2.4
  Bottom 0.203: v38.05,25.51 U$9.2
CAN-TX  (via drill 0.6)
  Top 0.203: v37.42,22.94 40.34,12.47 42.18,9.33 61.3,8.01 65.59,6.63 68.45,3.5 JP2.3
  Bottom 0.203: v37.42,22.94 U$9.3
CANH2
  Bottom 0.203: U$6.4 6.96,19.76 11.89,19.84 19.95,25.49 21.95,25.52 U$9.7
CANL2
  Bottom 0.203: U$6.3 11.97,18.63 19.32,22.93 21.96,22.96 U$9.6
CHG_FETDRV
  Bottom 0.203: R1.2 50.28,19.82 50.27,19.49 50.23,18.78 1401|1416.5
CHGR-V+
  Top 0.813: C8.1 65.39,21.18 60.77,21.33 U$7.C
  Top 1.016: U$10.2 60.84,23.22 60.78,21.49 60.77,21.33
  Top 1.27: C8.1 65.55,20.85
  Bottom 1.016: 72,21.57 JP11.2 | 72,21.57 70.75,21.53 69.64,20.62 C9.1 68.54,20.25 C8.1 | 72,21.57 73.15,21.93 73.49,21.4 R31.1
DRAIN$1
  Top 0.203: F$1.3 89.25,28.25 89.26,29.05 88.88,30.38 R$1.2
DRAIN$2
  Top 0.203: F$2.3 95.83,28.25 95.39,29.84 94.45,31.34 R$2.3
DRAIN$3
  Top 0.203: 101.88,28.1 F$3.3 101.83,28.12 100.92,29.74 R$3.3
DRAIN$4
  Top 0.203: F$4.3 106.83,28.04 106.23,29.63 106.01,30.09 R$4.3
DRAIN$5
  Top 0.203: R$5.3 111.61,29.13 112.37,27.97 F$5.3
DRAIN$6
  Top 0.203: F$6.3 117.55,28.29 116.95,29.46 116.21,30.34 R$6.3
DRAIN$7
  Top 0.203: F$7.3 123.66,28.26 123.13,28.74 | 123.13,28.74 123.04,28.82 | 123.13,28.74 123.08,28.69 R$7.3
DRAIN$8
  Top 0.203: F$8.3 128.51,28.07 128.44,29.02 128.43,28.98 128.04,30.28 R$8.3
DRAIN$9
  Top 0.203: F$9.3 134.27,27.81 133.57,28.84 | 133.57,28.84 133.53,28.89 | 133.57,28.84 R$9.3
DRAIN$10
  Top 0.203: F$10.3 136.79,16.29 135.85,15.47 135.66,13.53 R$10.3
DRAIN$11
  Top 0.203: F$11.3 131.85,16.81 131.83,15.5 130.5,14.47 130.31,13.32 R$11.3
DRAIN$12
  Top 0.203: F$12.3 126.79,17.51 126.84,15.93 125.22,14.73 124.72,13.3 R$12.3
DRAIN$13
  Top 0.203: F$13.3 121.8,17.48 121.75,15.83 119.82,14.18 R$13.3
DRAIN$14
  Top 0.203: F$14.3 116.5,17.43 116.58,15.77 114.45,14.32 113.62,13.23 R$14.3
DRAIN$15
  Top 0.203: F$15.3 111.67,17.53 111.57,15.56 109.71,14.75 108.03,13.18 R$15.3
DRAIN$16
  Top 0.203: F$16.3 106.5,17.51 106.42,15.42 105.4,14.93 104.61,14.41 102.43,13.23 R$16.3
DRAIN$17
  Top 0.203: 101.59,17.88 F$17.3 101.41,16.08 99.01,14.85 96.98,13.13 R$17.3
DRAIN$18
  Top 0.203: 95.41,17.57 F$18.3 95.48,17.55 95.43,15.85 93.31,15.33 R$18.3
FANFETGATE  (via drill 0.6)
  Top 0.203: JP2.5 72.14,5.32 66.73,7.8 v63.96,9.05 | v40.35,7.41 v59.93,5.99
  Bottom 0.203: v59.93,5.99 v63.96,9.05 | Q12.1 38.34,5.82 v40.35,7.41
FANPWN
  Bottom 0.305: U$11.P$4 19.6,2.85 18.11,6.86 JP9.4
FANTACH-H11DIODE
  Bottom 0.203: U$8.P$2 16.3,13.98 15.63,12.94 JP9.3
FANTACH-H11L1OUT  (via drill 0.6)
  Top 0.203: JP1.27 69.38,38.31 67.97,38 66.47,36.3 52.89,36.33 49.97,37.38 45.91,42.42 43.25,42.44 v40.44,40.28
  Bottom 0.203: U$8.P$4 28.39,17.31 28.32,29.35 29.17,29.76 34.72,29.8 39.37,39.55 39.43,39.52 v40.44,40.28
FANTACH-RESISTOR
  Bottom 0.203: R26.2 19.55,11.5 U$8.P$1
GHR_FET_GATE  (via drill 0.6)
  Top 0.203: U$12.1 50.11,22.38 v49.01,23.87
  Bottom 0.203: R1.1 v49.01,23.87
GND  (via drill 0.6)
  Top 0.203: 91.23,40.51 JP1.19
  Bottom 0.203: R6.2 86.76,8.81 | 38.68,13.93 IC1.2 38.47,14 | v41.38,23.34 45.06,22.6
  other vias: 46.77,22.67 44.4,20.22 46.67,20.23 44.35,22.68 45.68,21.49 130.52,22.27 84.38,22.54 102.37,25.34 107.87,25.28 113.11,25.3 111.63,19.73 134.25,25.49 115.21,38.63 138.51,39.07 56.38,12.37 82.65,33.8 72.82,34.13 89.66,37.98 85.65,31.23 138.43,8.67 138.53,6.51 66.43,10.94 40.93,37.59 75.34,25.94 82.37,28.08 85.52,28.54 34.54,33.33 40.73,26.49 118.31,25.24 123.71,25.44 128.75,25.32 96.74,25.36 48.02,43.44 52.29,43.33 53.68,37.81 51.94,38.08 54.93,34.39 58.95,34.45 53.3,23.81 50.97,24.73 75.26,23.25 75.34,21.5 75.45,17.92 75.48,16.07 75.46,13.24 75.54,11.02 73.06,27.48 69.89,33.71 68.06,29.29 89.78,43.64 84.8,43.54 79.59,43.58 74.74,43.41 69.58,43.41 64.51,43.35 61.62,39.27 58.96,43.27 61.85,43.32 92.48,43.61 97.35,43.55 102.51,43.59 107.7,43.5 112.74,43.42 117.84,43.44 122.84,43.44 127.98,43.47 132.97,43.44 138.25,43.5 82.16,1.2 87.29,1.27 92.33,1.16 97.41,1.23 102.54,1.16 107.59,1.19 112.71,1.15 117.76,1.22 122.88,1.18 127.93,1.18 132.76,1.29 138.34,1.37
  pour Bottom (rank 2): 30.6,36.44 29.17,31.66 28.74,13.59 28.31,10.22 28.35,-0.8 60.72,-0.72 80.14,-0.9 74.18,9.3 73.96,16.77 75.14,17.96 75.1,22.82 69.94,23.19 66.67,25.98 60.66,26.09 60.07,47.29 45.39,47.32
  pour Top (rank 2): 44.38,46.92 60.03,46.97 60.21,34.81 60.66,26.13 66.78,26.04 70.01,23.24 73.98,22.65 75,22.59 75.09,17.38 73.84,17.05 74.12,9.38 80.49,-1.42 60.95,-1.83 26.86,-1.31 28.45,3.64 28.13,9.35 28.07,13.16 28.39,31.19 30.94,37.12
  pour Bottom: 61.19,27.62 61.24,26.65 66.79,26.61 70.1,24.18 74.51,23.15 74.73,16.96 74.84,9.39 77.92,3.8 81.76,-2.04 143.51,-2.8 143.51,46.38 60.64,46.88
  pour Top: 81.83,-1.01 141.38,-1.3 141.38,46.8 60.74,46.82 61.24,26.68 67,26.65 70.18,23.82 74.5,23.17 74.92,10.49
GNDA  (via drill 0.6, 1)
  Top 0.203: JP9.1 10.01,7.02 9.53,6.9 1401|1.4 7.16,6.88 6.67,7.83 6.67,9.26 4.82,10.01 v4.71,10.41 | v20.3,4.37 20.94,5.08 U$15.P$5
  Top 1.27: U$6.5 10.6,21 11.3,20.73 13.2,20.79
  Bottom 0.203: R35.1 27.84,41.92 26.91,41.89 26.67,41.91 | U$11.P$5 20.52,5.42 v20.3,4.37 | Q4.2 v4.71,10.41
  other vias: 12.15,22.19 16.72,25.43 8.21,29.74 6.02,29.84 15.8,15.65 14.09,17.79 25.08,37.09
  pour Bottom (rank 3): 26.32,46.79 27.19,37.54 23.38,33.88 23.65,0.06 -0.17,-0.11 -0.79,46.76
  pour Top (rank 4): 28.58,46.44 -0.39,46.47 -1.38,-1.2 22.49,-0.37 24.39,33.84 28.96,39.13
H11L-PWM-R
  Bottom 0.203: U$11.P$1 32.57,7.96 32.58,7.94 33.65,7.94 34.97,8.86 R3.1
H11PWM-FETDRV
  Bottom 0.203: Q12.3 34.39,4.83 33.73,4.79 33.34,5.23 33,5.48 U$11.P$2
HE-G5
  Top 0.203: JP7.2 70.74,28.59 72.93,29.82 75.22,34.81 76.76,35.95 79.97,36.17 87.9,37.57 88.55,39.89 88.58,40.46 JP1.20
LED1A
  Top 0.203: LED1.A 61.06,11.7 R7.2
LED1DRIVE
  Bottom 0.203: JP8.1 43.11,3.36 R2.1
LED1FETDRAIN
  Bottom 0.203: Q2.3 45.92,9.79 43.52,7.99 41.38,6.67 R2.2
LED1R  (via drill 0.6)
  Top 0.203: JP2.6 76.03,3.4 74.21,5.44 66.98,8.66 R7.1 64.36,10.75 63.79,10.32 62.89,10.2 60.46,10.21 57.15,10.48 v52.79,10.98
  Bottom 0.203: Q2.1 v52.79,10.98
LED2  (via drill 0.6)
  Top 0.203: JP2.7 76.52,5.55 72.26,6.99 v68.37,9.98 | v58.65,3.04 v61.33,5.14
  Bottom 0.203: v68.37,9.98 63.94,7.45 v61.33,5.14 | Q3.1 57.08,4.85 57.67,4.81 v58.65,3.04
LED2DRIVE
  Bottom 0.203: JP8.2 45.67,3.29 47.29,5.93 51.16,5.92 R4.1
LED2FETDRAIN
  Bottom 0.203: R4.2 53.1,3.01 53.34,3.87 54.3,3.86 Q3.3
LED_BUS_PWR  (via drill 0.6)
  Top 0.203: LED2.C 32.77,41.42 v33.61,41.42
  Bottom 0.203: v33.61,41.42 R35.2
MASTER-RESET-PROC  (via drill 0.6)
  Top 0.203: JP1.26 71.56,38.08 68.48,36.97 66.75,35.51 52.81,35.5 49.4,36.58 38.73,36.38 v34.94,36.47
  Bottom 0.203: U$13.P$4 30.94,36.37 v34.94,36.47
MASTER-RESET-RESISTOR  (via drill 0.6)
  Top 0.203: D3.C 22.78,31.03 v21.01,30.55
  Bottom 0.203: R30.2 21.94,31.26 U$13.P$1 v21.01,30.55
MASTER-RESET-SYS  (via drill 0.6)
  Top 0.203: v16.31,29.23 v19.92,33.78 19.94,33.75 D3.A
  Bottom 0.203: U$6.6 6.3,22.34 8.48,22.33 v16.31,29.23 | U$13.P$2 21.88,33.76 v19.92,33.78
MCP1416_IN  (via drill 0.6)
  Top 0.203: 53.07,13.61 52.79,13.62 v49.33,12.8 | 53.07,13.61 63.83,13.36 69.5,11.1 71.81,8.73 72.51,8.29 76.46,6.76 79.76,5.59 80.95,3.46 JP2.8 | 53.07,13.61 | R29.2 53.07,15.04 53.07,13.61
  Bottom 0.203: 1401|1416.3 48.29,13.78 48.33,13.78 v49.33,12.8
N$1  (via drill 0.6)
  Top 0.203: F$18.1 93.36,18.37 v92.06,18.54 | R20.2 95.55,8.52 92.64,9.86 92.62,11.34 93.5,12.22 94.25,13.17 v94.57,13.7
  Bottom 0.203: v94.57,13.7 v92.06,18.54
N$2
  Bottom 0.61: R33.1 8.76,35.51 8.82,36.43 U$1.2
N$6
  Top 0.813: U$12.3 55.86,21.39 U$7.A 56.04,21.39 55.96,23.59
  Top 1.27: 55.96,23.59 55.99,26.75 57.3,28.98 U$4.P$1 56.37,30.9 U$4.P$3 56.86,32.96 U$4.P$5
N$9  (via drill 0.6)
  Top 0.203: F$17.1 98.49,18.84 v97.86,19.37 | R21.2 100.45,8.4 98.72,9.59 98.21,10.12 98.29,11.33 98.87,12.1 99.83,12.85 v100.36,13.08
  Bottom 0.203: v100.36,13.08 v97.86,19.37
N$16  (via drill 0.6)
  Top 0.203: F$16.1 104.45,18.39 v103.19,19.25 | R22.2 106.28,8.75 104.33,9.39 103.71,9.87 103.77,11.51 105.94,13.67 v105.9,13.66
  Bottom 0.203: v105.9,13.66 v103.19,19.25
N$17  (via drill 0.6)
  Top 0.203: F$15.1 109.54,18.39 v109.19,19.84 | R23.2 111.4,8.54 109.32,9.86 109.32,11.39 110.04,12.09 111.55,13.35 v111.55,13.37
  Bottom 0.203: v111.55,13.37 v109.19,19.84
N$18  (via drill 0.6)
  Top 0.203: F$14.1 114.39,18.47 v113.99,19.83 | R24.2 116.05,8.71 114.99,9.78 114.99,11.52 115.79,12.96 117.18,13.92 v117.2,13.96
  Bottom 0.203: v117.2,13.96 v113.99,19.83
N$19  (via drill 0.6)
  Top 0.203: F$13.1 119.64,18.44 v119.15,19.87 | R25.2 121.05,8.57 120.67,10.01 120.68,11.59 122.65,14.06 v122.56,14.03
  Bottom 0.203: v122.56,14.03 v119.15,19.87
N$20  (via drill 0.6)
  Top 0.203: R14.2 125.4,35.76 125.44,35.05 125.44,33.29 124.87,32.65 v123.65,31.78 | F$7.1 126.24,26.86 v126.57,25.57
  Bottom 0.203: v126.57,25.57 v123.65,31.78
N$21  (via drill 0.6)
  Top 0.203: R15.2 130.39,35.84 130.81,34.43 130.86,33.2 130.31,32.56 v129.15,31.8 | F$8.1 131.22,26.82 v131.31,25.45
  Bottom 0.203: v131.31,25.45 v129.15,31.8
N$22  (via drill 0.6)
  Top 0.203: R16.2 136.31,33.59 136.31,31.12 v135.65,30.46 | F$9.1 136.44,26.8 v136.28,25.34
  Bottom 0.203: v136.28,25.34 v135.65,30.46
N$23  (via drill 0.6)
  Top 0.203: F$10.1 133.77,18.33 v133.63,19.74 | R17.2 135.86,8.5 137,9.23 136.95,12.15 137.35,13.32 136.9,14.92 v136.88,14.88
  Bottom 0.203: v136.88,14.88 v133.63,19.74
N$24  (via drill 0.6)
  Top 0.203: F$11.1 129.62,18.49 v129.17,19.87 | R18.2 131.49,8.46 131.73,9.54 131.74,11.64 133.36,13.87 v133.39,13.78
  Bottom 0.203: v133.39,13.78 v129.17,19.87
N$25  (via drill 0.6)
  Top 0.203: F$12.1 124.71,18.44 v124.14,19.92 | R19.2 125.53,9 126.04,10.11 126.14,11.57 128.11,14.01 v128.12,13.97
  Bottom 0.203: v128.12,13.97 v124.14,19.92
N$26  (via drill 0.6)
  Top 0.203: R8.2 120.21,35.58 120.22,34.88 120.09,33.25 119.37,32.44 v118.38,31.68 | F$6.1 120.09,26.97 v120.68,25.73
  Bottom 0.203: v120.68,25.73 v118.38,31.68
N$27  (via drill 0.6)
  Top 0.203: R9.2 115.12,35.65 114.8,34.97 114.8,33.56 114.01,32.72 v113.31,31.59 | F$5.1 115.18,26.97 v115.63,25.69
  Bottom 0.203: v115.63,25.69 v113.31,31.59
N$28  (via drill 0.6)
  Top 0.203: R10.2 110.14,35.93 109.35,35.38 109.33,33.51 108.75,32.71 v107.83,31.61 | F$4.1 109.59,27.02 v110.08,25.79
  Bottom 0.203: v110.08,25.79 v107.83,31.61
N$29  (via drill 0.6)
  Top 0.203: R11.2 104.66,36.04 104.62,35.51 103.72,34.72 103.65,32.79 103.3,32.25 v102.28,31.63 | F$3.1 104.02,27.17 v104.68,25.91
  Bottom 0.203: v104.68,25.91 v102.28,31.63
N$30  (via drill 0.6)
  Top 0.203: R12.2 99.78,36.32 98.28,35.29 98.14,33.59 97.79,32.54 v96.78,31.93 | F$2.1 97.95,27.28 v99.07,26.17
  Bottom 0.203: v99.07,26.17 v96.78,31.93
N$49  (via drill 0.6)
  Top 0.203: R13.2 94.34,35.82 93.35,35.76 93.09,34.91 93.12,33.02 92.54,32.4 v91.57,31.95 | F$1.1 92.28,26.54 v92.71,26.04
  Bottom 0.203: v92.71,26.04 v91.57,31.95
PC7-FET-DRAIN
  Top 0.203: Q1.3 33.37,5.9 32.82,5.15 31.49,5.12 U$15.P$2
PC7-T8C1
  Top 0.203: JP1.24 76.7,44.43 40.49,44.59 30.43,36.98 28.1,31.08 28.04,11.61 36.22,9.2 38.15,8.14 38.19,5.94 37.71,5.19 37.29,5.01 Q1.1
S1
  Top 0.203: 92.53,38.11 92.49,37.57 | 92.53,38.11 92.55,38.34 93.74,40.5 JP1.18 | R$2.2 91.85,33.81 91.41,35.37 91.46,37.31 R13.1 92.71,36.83 92.71,38.1 92.53,38.11
S2
  Top 0.203: JP1.16 98.84,40.43 98.15,38.48 R12.1 98.04,36.81 | 98.04,36.81 98.01,36.36 97.2,35.45 R$3.2 | R12.1 97.79,36.83 98.04,36.81
S3
  Top 0.203: JP1.14 103.91,40.52 103.12,38.41 103.12,37.19 102.87,36.83 R11.1 102.88,35.87 102.55,34.87 102.48,33.83 R$4.2
S4
  Top 0.203: 108.39,38.12 108.45,36.96 | 108.39,38.12 108.38,38.23 109,40.5 JP1.12 | R$5.2 108.06,33.91 108.35,35.42 R10.1 107.95,36.83 107.95,38.1 108.39,38.12
S5
  Top 0.203: 113.41,36.74 113.41,38.03 114.01,40.46 JP1.10 | R$6.2 113.52,33.97 113.41,36.74 | R9.1 113.03,36.83 113.41,36.74
S6
  Top 0.203: 118.33,36.84 118.29,37.96 119.16,40.52 JP1.8 | 118.33,36.84 118.34,36.56 | R$7.2 118.86,33.82 118.46,34.85 R8.1 118.11,36.83 118.33,36.84
S7
  Top 0.203: 123.58,38.13 123.69,36.76 | 123.58,38.13 123.56,38.33 124.2,40.46 JP1.6 | R14.1 123.74,35.58 124.23,33.9 R$8.2 124.46,34.29 123.19,34.29 123.19,38.1 123.58,38.13
S8
  Top 0.203: JP1.4 129.61,40.49 129.62,40.44 128.58,38.75 128.7,36.81 R15.1 128.7,35.58 129.54,34.35 129.54,34.29 R$9.2
S9  (via drill 0.6)
  Top 0.203: JP1.2 134.39,40.41 134.08,38.75 134.03,36.37 R16.1 134.09,36.44 v134.22,31.91 | R$10.2 138.18,11.04 137.99,13.07 137.91,13.71 138.36,14.48 139.02,14.91 138.9,25.93 v138.17,26.09
  Bottom 0.203: v138.17,26.09 138.07,29.24 137.01,31.87 v134.22,31.91
S10
  Top 0.203: R$11.2 132.89,10.89 133.27,9.41 134.16,8.41 R17.1 134.2,7.5 134.25,6.36 135.41,5.62 JP2.30
S11
  Top 0.203: R$12.2 127.33,10.79 127.71,9.41 129.45,8.35 R18.1 129.59,7.37 129.6,6.26 130.6,5.64 JP2.28
S12
  Top 0.203: R$13.2 121.95,10.77 122.74,9.09 124.4,8.17 R19.1 124.46,7.42 124.39,6.17 125.46,5.39 JP2.26
S13
  Top 0.203: R$14.2 116.27,10.69 117.37,9.07 119.21,8.17 R25.1 119.29,7.37 119.43,6.14 120.07,5.67 JP2.24
S14
  Top 0.203: JP2.22 114.46,5.94 114.34,7.19 R24.1 114.49,7.18 114.46,8.11 112.89,9.11 R$15.2
S15
  Top 0.203: JP2.20 109.73,6.09 109.76,7.4 R23.1 109.86,7.32 109.83,8.3 108.62,8.59 R$16.2
S16
  Top 0.203: JP2.18 105.29,5.63 104.55,5.94 104.48,7.19 R22.1 104.55,7.18 104.49,8.01 102.04,8.93 R$17.2
S17
  Top 0.203: JP2.16 99.99,5.66 98.78,6.11 R21.1 98.8,7.28 98.78,8.35 95.7,9.19 R$18.2
S18
  Top 0.203: 96.29,3.37 JP2.14 94.79,5.63 93.88,6.47 93.88,7.54 R20.1 89.3,9.88 88.61,12.7 R$19.1
SWCLK
  Top 0.203: JP1.28 65.98,37.31 55.8,37.26 53.51,40.5 JP5.2
SWO
  Top 0.203: 56,40.5 JP5.3 56.01,40.45 57.93,38.14 64.64,38.13 JP1.29
THERM1-G2
  Top 0.203: JP10.5 67.31,34.71 68.47,35.83 72.86,37.43 79.55,37.65 80.6,39.42 80.58,39.46 80.99,40.48 JP1.23
THERM2-G3
  Top 0.203: JP10.3 65.44,31.39 67.3,33.11 68.69,35.28 72.99,36.95 79.76,37.16 83.28,39.51 83.49,40.46 JP1.22
THERM3-G4
  Top 0.203: JP10.1 65.42,28.71 66.86,30.08 67.78,31.93 68.92,34.71 73.22,36.46 79.9,36.69 85.04,38.64 85.57,39.57 86.06,40.49 JP1.21
U$15-H11L-ANODE
  Top 0.203: U$15.P$1 31.52,2.57 R32.2
U$15OUT  (via drill 0.6)
  Top 0.203: U$15.P$4 20.54,6.61 19.14,4.62 17.73,2.7 JP13.4 17.75,2.68 16.48,0.43 8.38,0.44 7.57,1.25 | 7.57,1.25 7.17,1.64 7.17,4.69 6.48,6.02 1401|1.3 v3.86,6.98 | 7.57,1.25 v7.53,1.23
  Bottom 0.203: JP13.4 17.8,2.79 | R36.1 v7.53,1.23 | v3.86,6.98 Q4.1
USART1-RX
  Top 0.203: JP4.4 63.98,15.88 64.57,14.67 68.35,12.91 71.9,11.46 73.21,11.45 76.85,8.56 85.03,6.77 86.06,3.44 JP2.10
USART1-TX  (via drill 0.6)
  Top 0.203: v72.88,10 75.19,8.14 82.41,5.82 83.53,3.48 JP2.9 | v72.58,12.87 69.58,13.5 67.73,14.59 66.48,15.91 JP4.5
  Bottom 0.203: v72.88,10 v72.58,12.87

### Text on the board
bNames: 5
tValues: 3.3V | DIGITAL | +5V | 3.2v | ANALOG | 3.2